# EAGLE design ESP32_breakout v3 (EAGLE 7.7.0)
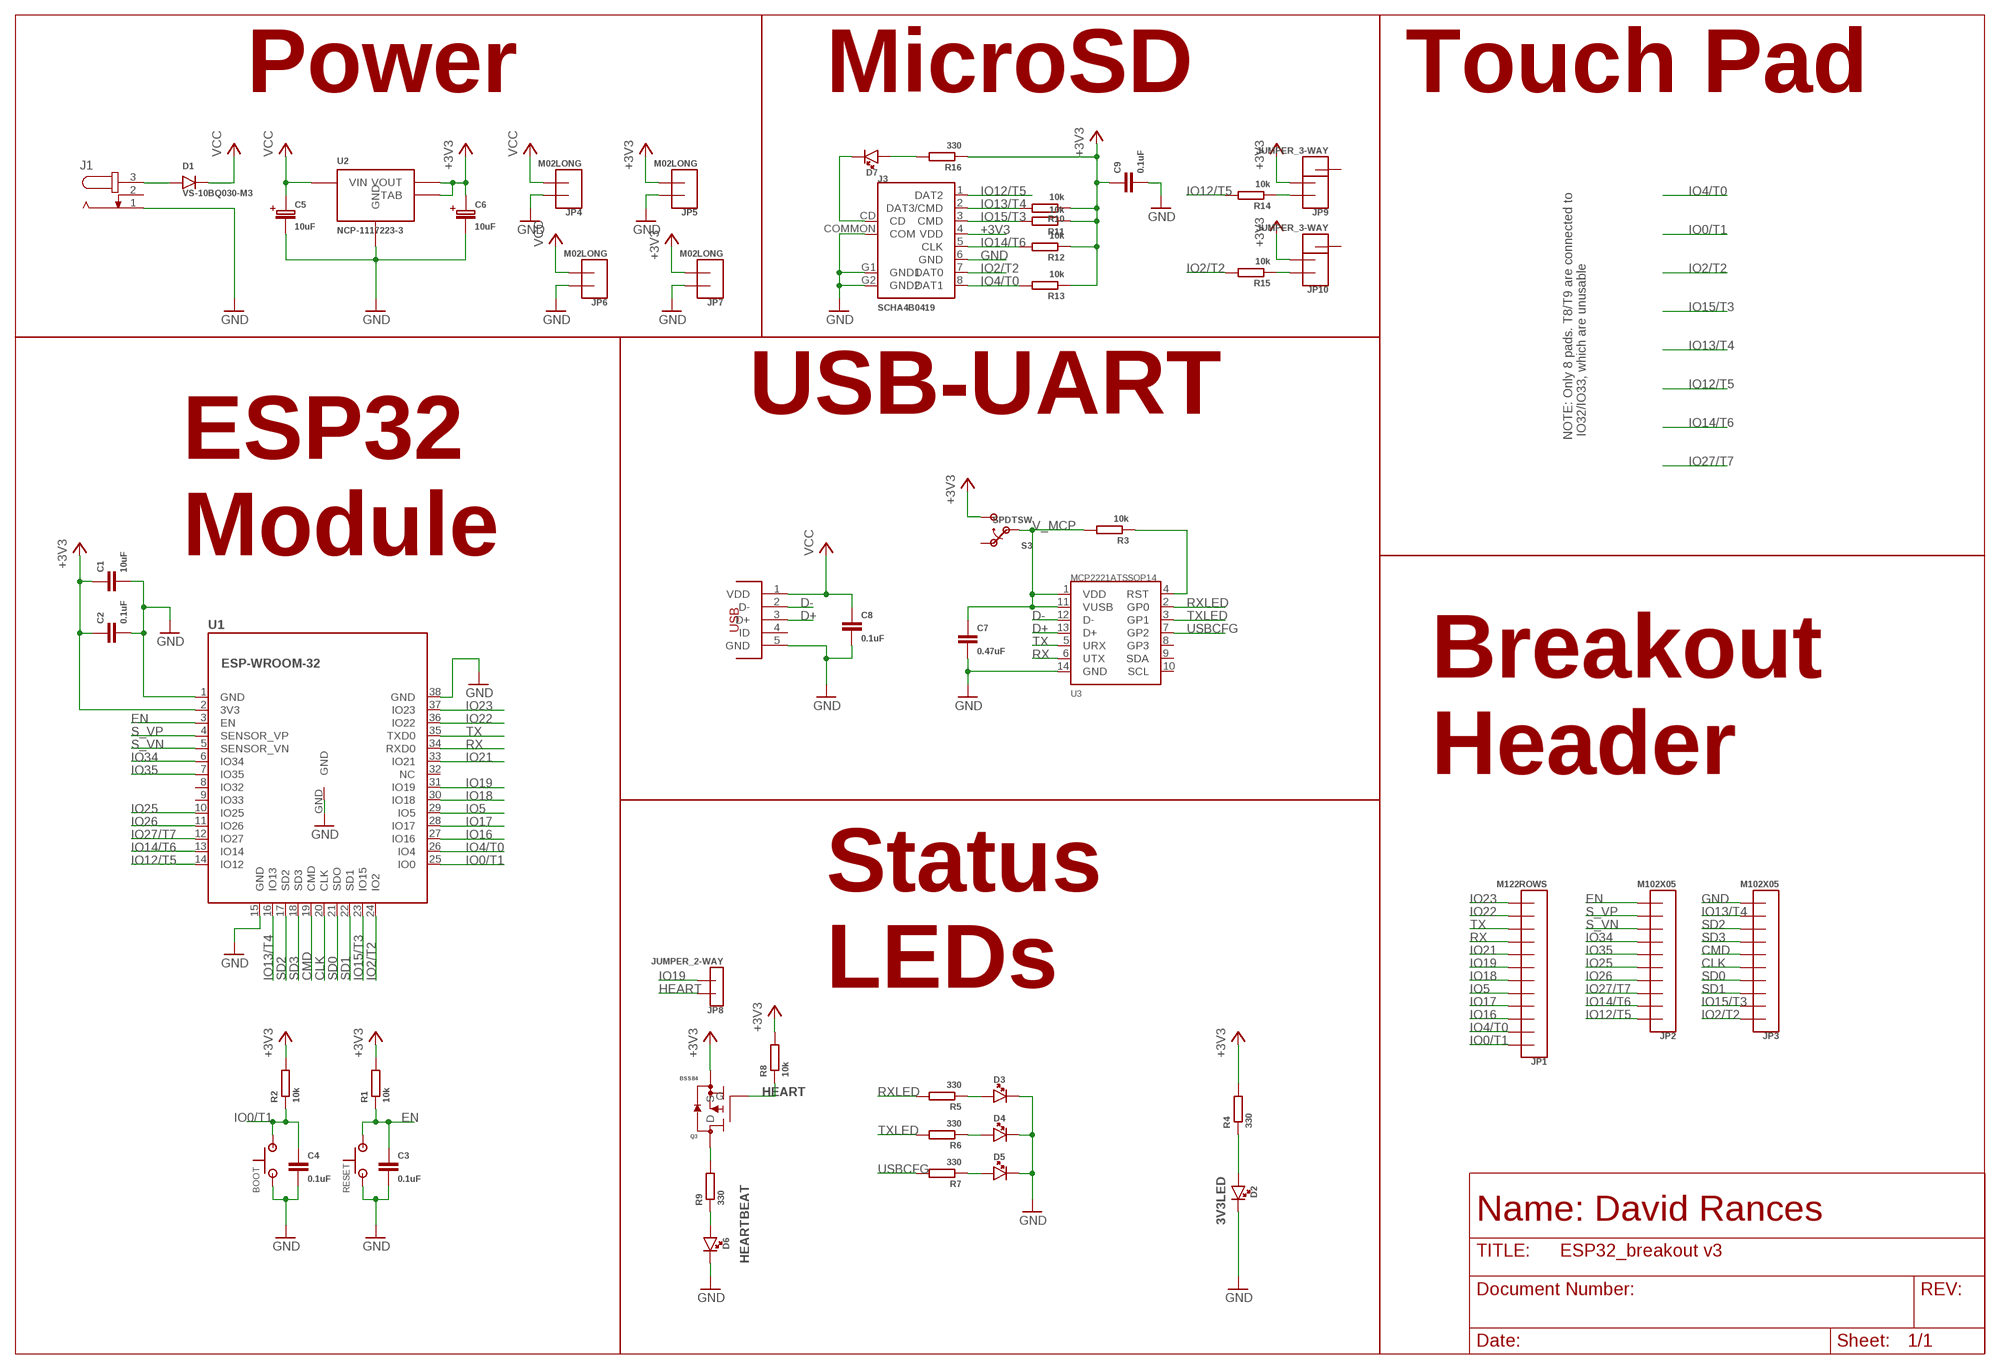
[diagram p0: schematic, sheet 1]

## Parts
BOOT  PUSHBUTTONSKHMQME010  [SKHMQME010]
C1  10uF  CAP0603  [CAP-0603]
C2  0.1uF  CAP0603  [CAP-0603]
C3  0.1uF  CAP0603  [CAP-0603]
C4  0.1uF  CAP0603  [CAP-0603]
C5  10uF  CAP-POLARCASEB-3528  [B-3528]
C6  10uF  CAP-POLARCASEB-3528  [B-3528]
C7  0.47uF  CAP0603  [CAP-0603]
C8  0.1uF  CAP0603  [CAP-0603]
C9  0.1uF  CAP0603  [CAP-0603]
D1  VS-10BQ030-M3  [DO-214AA]
D2  LED1206  [LED-1206]
D3  LED1206  [LED-1206]
D4  LED1206  [LED-1206]
D5  LED1206  [LED-1206]
D6  LED1206  [LED-1206]
D7  LED1206  [LED-1206]
J1  JACK-PLUG0  [SPC4077]
J3  SCHA4B0419  [MICROSD_SCHA4B0419]
JP1  M122ROWS  [2X06]
JP2  M102X05  [2X05]
JP3  M102X05  [2X05]
JP4  M02LONG  [1X02-LONG]
JP5  M02LONG  [1X02-LONG]
JP6  M02LONG  [1X02-LONG]
JP7  M02LONG  [1X02-LONG]
JP8  JUMPER_2-WAY  [1X02]
JP9  JUMPER_3-WAY  [1X03]
JP10  JUMPER_3-WAY  [1X03]
Q3  BSS84  [SOT-23-3]
R1  10k  RESISTOR0603  [RES-0603]
R2  10k  RESISTOR0603  [RES-0603]
R3  10k  RESISTOR0603  [RES-0603]
R4  330  RESISTOR0603  [RES-0603]
R5  330  RESISTOR0603  [RES-0603]
R6  330  RESISTOR0603  [RES-0603]
R7  330  RESISTOR0603  [RES-0603]
R8  10k  RESISTOR0603  [RES-0603]
R9  330  RESISTOR0603  [RES-0603]
R10  10k  RESISTOR0603  [RES-0603]
R11  10k  RESISTOR0603  [RES-0603]
R12  10k  RESISTOR0603  [RES-0603]
R13  10k  RESISTOR0603  [RES-0603]
R14  10k  RESISTOR0603  [RES-0603]
R15  10k  RESISTOR0603  [RES-0603]
R16  330  RESISTOR0603  [RES-0603]
RESET  PUSHBUTTONSKHMQME010  [SKHMQME010]
S3  SPDTSW  [SPDT_TH]
U1  ESP-WROOM-32  [ESP-WROOM-32]
U2  NCP-1117223-3  [SOT-223-3]
U3  MCP2221ATSSOP14  [TSSOP-14]
U$4  MOLEX_USBMICRO  [MOLEX_47346-001]

## Nets
+3V3: C1.1 C2.1 C6.P C9.1 J3.4(VDD) JP5.2 JP7.2 JP9.2 JP10.2 Q3.S R1.2 R2.2 R4.2 R8.2 R10.1 R11.1 R12.1 R13.1 R16.1 S3.3 U1.2(3V3) U2.2(VOUT) U2.PAD(TAB)
CLK: JP3.5 U1.20(CLK)
CMD: JP3.6 U1.19(CMD)
D+: U3.13(D+) U$4.3(D+)
D-: U3.12(D-) U$4.2(D-)
EN: C3.1 JP2.10 R1.1 RESET.3 RESET.4 U1.3(EN)
GND: BOOT.1 BOOT.2 C1.2 C2.2 C3.2 C4.2 C5.N C6.N C7.2 C8.2 C9.2 D2.C D3.C D4.C D5.C D6.C J1.1 J3.6(GND) J3.COMMON(COM) J3.G1(GND1) J3.G2(GND2) JP3.10 JP4.1 JP5.1 JP6.1 JP7.1 RESET.1 RESET.2 U1.1(GND) U1.15(GND) U1.38(GND) U1.GND U2.1(GND) U3.14(GND) U$4.5(GND)
HEART: JP8.1 Q3.G R8.1
IO0/T1: BOOT.3 BOOT.4 C4.1 JP1.1 R2.1 U1.25(IO0)
IO2/T2: J3.7(DAT0) JP3.1 R15.2 U1.24(IO2)
IO4/T0: J3.8(DAT1) JP1.2 R13.2 U1.26(IO4)
IO5: JP1.5 U1.29(IO5)
IO12/T5: J3.1(DAT2) JP2.1 R14.2 U1.14(IO12)
IO13/T4: J3.2(DAT3/CMD) JP3.9 R10.2 U1.16(IO13)
IO14/T6: J3.5(CLK) JP2.2 R12.2 U1.13(IO14)
IO15/T3: J3.3(CMD) JP3.2 R11.2 U1.23(IO15)
IO16: JP1.3 U1.27(IO16)
IO17: JP1.4 U1.28(IO17)
IO18: JP1.6 U1.30(IO18)
IO19: JP1.7 JP8.2 U1.31(IO19)
IO21: JP1.8 U1.33(IO21)
IO22: JP1.11 U1.36(IO22)
IO23: JP1.12 U1.37(IO23)
IO25: JP2.5 U1.10(IO25)
IO26: JP2.4 U1.11(IO26)
IO27/T7: JP2.3 U1.12(IO27)
IO34: JP2.7 U1.6(IO34)
IO35: JP2.6 U1.7(IO35)
N$2: D1.A J1.3
N$3: R3.1 U3.4(RST)
N$4: D5.A R7.1
N$5: D2.A R4.1
N$6: JP9.1 R14.1
N$7: JP10.1 R15.1
N$8: D3.A R5.1
N$9: D6.A R9.1
N$10: Q3.D R9.2
N$11: D4.A R6.1
N$12: D7.C J3.CD
N$14: D7.A R16.2
RX: JP1.9 U1.34(RXD0) U3.6(UTX)
RXLED: R5.2 U3.2(GP0)
S_VN: JP2.8 U1.5(SENSOR_VN)
S_VP: JP2.9 U1.4(SENSOR_VP)
SD0: JP3.4 U1.21(SDO)
SD1: JP3.3 U1.22(SD1)
SD2: JP3.8 U1.17(SD2)
SD3: JP3.7 U1.18(SD3)
TX: JP1.10 U1.35(TXD0) U3.5(URX)
TXLED: R6.2 U3.3(GP1)
USBCFG: R7.2 U3.7(GP2)
V_MCP: C7.1 R3.2 S3.2(OUT) U3.1(VDD) U3.11(VUSB)
VCC: C5.P C8.1 D1.C JP4.2 JP6.2 U2.3(VIN) U$4.1(VDD)
Unconnected: BOOT.5 J1.2 JP9.3 JP10.3 RESET.5 S3.1 U1.8(IO32) U1.9(IO33) U1.32(NC) U3.8(GP3) U3.9(SDA) U3.10(SCL) U$4.4(ID)

## Notes on the sheet
- Power | MicroSD | Touch Pad
- USB-UART
- NOTE: Only 8 pads. T8/T9 are connected to
   IO32/IO33, which are unusable
- ESP32
  Module
- Breakout
  Header
- Status
  LEDs
- Name: David Rances
- 3V3LED
- HEARTBEAT

## Library data of the parts
BOOT RESET = dr-library:PUSHBUTTON: ALPS Tactile Switch 50mA at 12V Mouser Product # 688-SKHMQME010
C1-C4 C7-C9 = dr-library:CAP: Multilayer Ceramic Capacitor
C5 C6 = dr-library:CAP-POLAR
D1 = dr-library:VS-10BQ030-M3: Vishay Semiconductors High Performance Schottky Rectifier 1.0A Mfg. No. VS-10BQ030-M3/5BT http://www.mouser.com/ds/2/427/vs-10bq030-m3-552919.pdf
D2-D7 = dr-library:LED
J1 = EmbeddedAdventures 3:JACK-PLUG: DC POWER JACK Power Jack, DC, Right Angle, Through Hole, Rated 5A at 16VDC, PC Terminals Distributor: Farnell (www.Farnell.de) Drawing: 84N1161.pdf / 84N1162.pdf Manufacturer: SPC Technology (www.spctechnology.com) Type: SPC4077 / SPC 4078
J3 = dr-library:SCHA4B0419: ALPS MicroSD Connector Manufacturer No. SCHA4B0419 http://www2.mouser.com/ProductDetail/ALPS/SCHA4B0419/?qs=sGAEpiMZZMuJakaoiLiBpsFSICW6cUCj0ci6XSEAGXcTwv1T7afZMw%3d%3d
JP1 = dr-library:M12
JP2 JP3 = dr-library:M10
JP4-JP7 = dr-library:M02
JP8 = dr-library:JUMPER_2-WAY
JP9 JP10 = dr-library:JUMPER_3-WAY
Q3 = dr-library:BSS84: Fairchild Semiconductor P-Channel Enhancement Mode MOSFET Mfg. No. BSS84 Mouser No. 512-BSS84 http://www.mouser.com/ds/2/149/BSS84-1006729.pdf
R1-R16 = dr-library:RESISTOR
S3 = dr-library:SPDT
U1 = dr-library:ESP-WROOM-32
U2 = dr-library:NCP-1117: ON Semiconductor Low Dropout Positive Voltage Regulator 1A output Datasheet: http://www.mouser.com/ds/2/308/NCP1117LP-D-82673.pdf
U3 = dr-library:MCP2221A: MCP2221A USB 2.0 to I2C/UART Protocol Converter with GPIO Microchip http://ww1.microchip.com/downloads/en/DeviceDoc/20005565B.pdf Mouser Part #579-MCP2221A-I/ST
U$4 = dr-library:MOLEX_USBMICRO

## Board
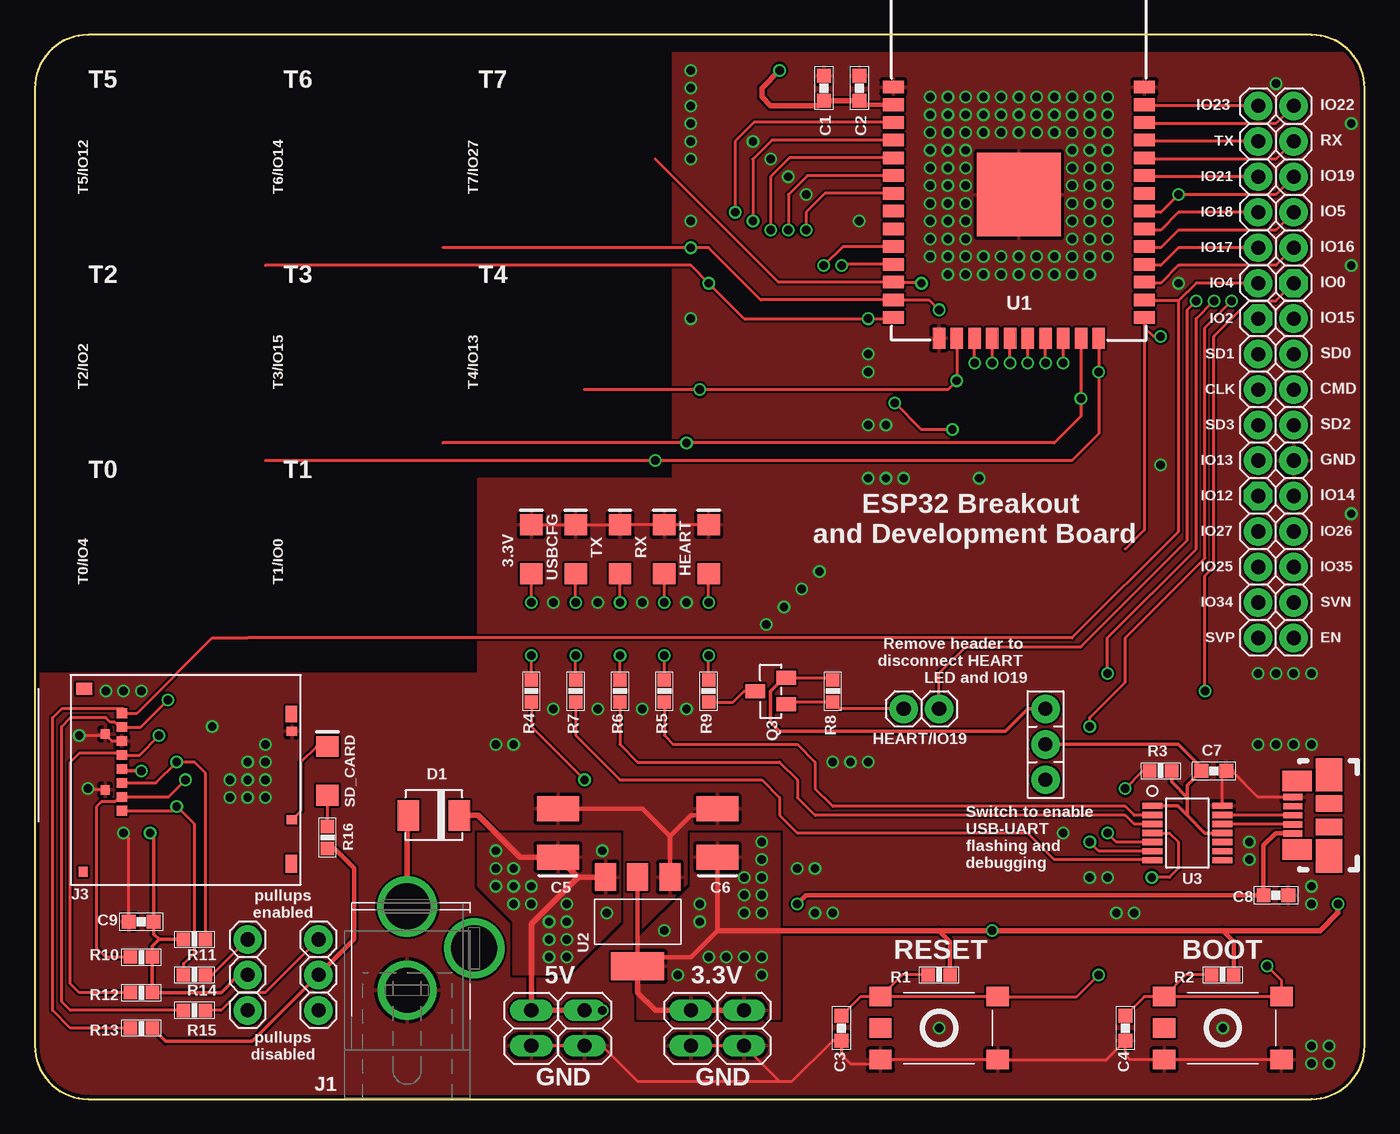
[diagram p1: board, top side]
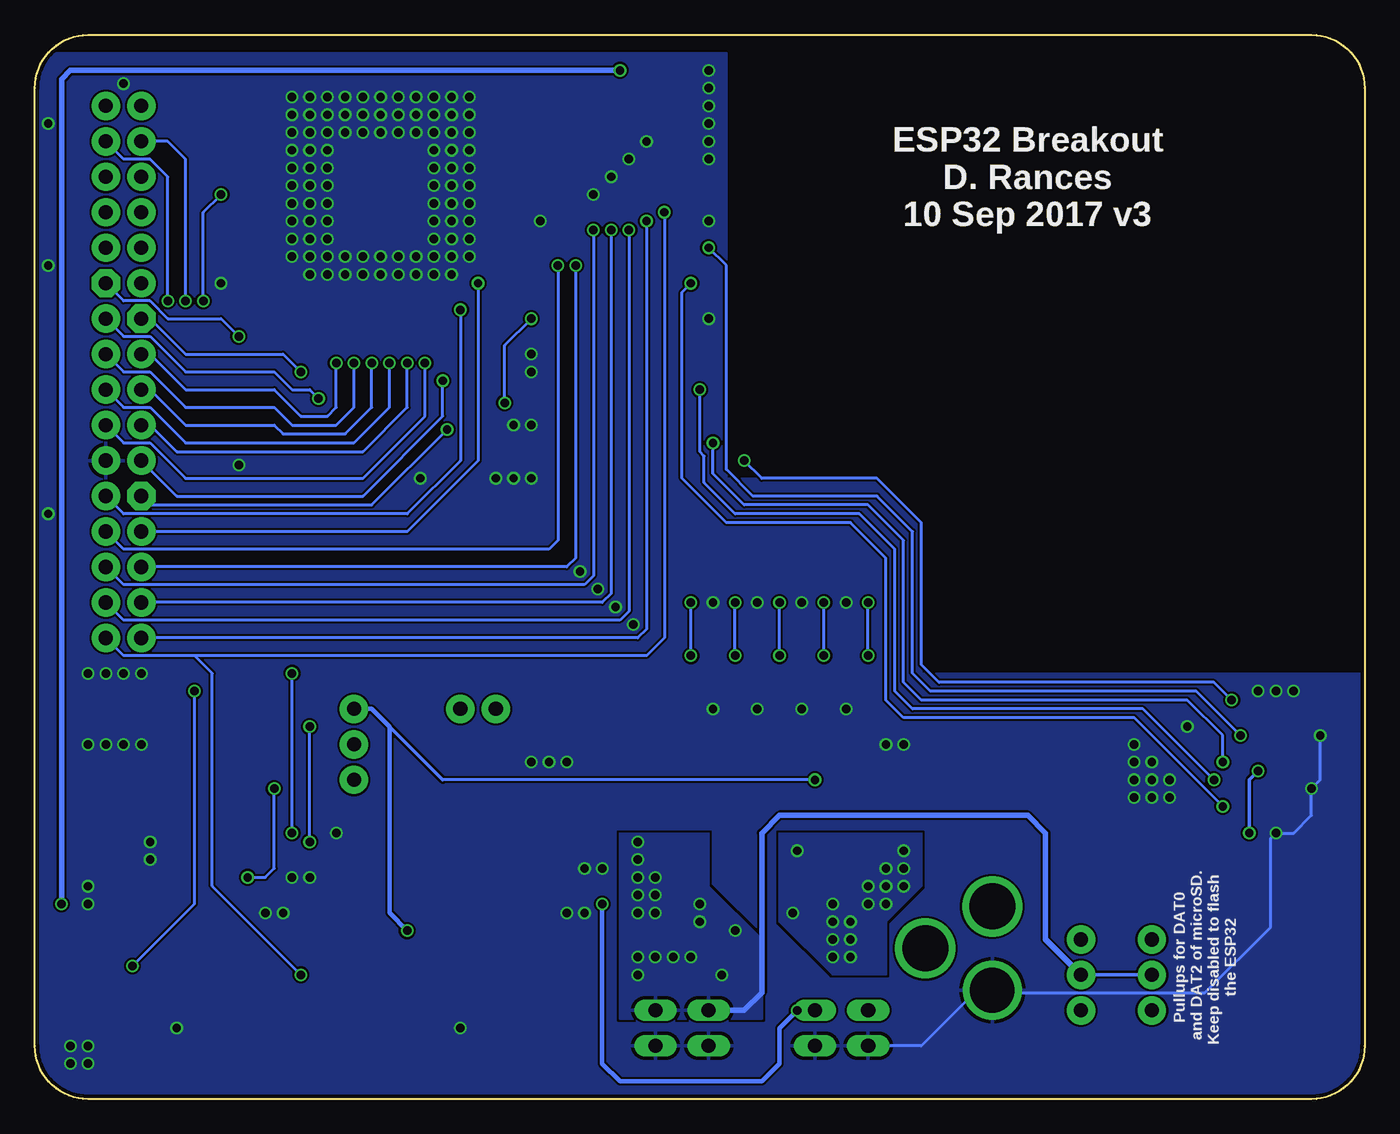
[diagram p2: board, bottom side, seen from below]

Size 95.25 x 76.2 mm. Coordinates in mm from the lower left corner, seen from the top.
Outline: 3.81,76.2 arc90 0,72.39 0,3.81 arc90 3.81,0 91.44,0 arc90 95.25,3.81 95.25,72.39 arc90 91.44,76.2 3.81,76.2
Copper layers (1*16): Top 0.035mm / dielectric 1.5mm / Bottom 0.035mm
Design rules "SeeedStudio_2layer_DRU_no_angle_20140221": minimum track width 6mil, minimum drill 12mil, track to track 6mil, track to pad 6mil, pad to pad 6mil, via to via 6mil, smd to smd 0mil, copper to edge 10mil, drill to drill 10mil, minimum pad ring 10mil, minimum via ring 6mil, stop-mask expansion 2mil, vias tented up to drill 100mil, thermal gap 10mil
tKeepout: 6 lines

### Footprints (pad centres in the part's own frame; a part is rotated, then mirrored left to right if it is on the bottom)
SKHMQME010 = smd 1.6 x 1.4: 1 -4.2,2.25; 2 4.2,2.25; 3 -4.2,-2.25; 4 4.2,-2.25; 5 4.2,0
CAP-0603 = smd 1 x 1: 1 -0.889,0; 2 0.889,0
B-3528 = smd 1.8 x 3: N 1.725,0; P -1.725,0
DO-214AA = smd 1.52 x 2.18: A 1.83,0; C -1.83,0
LED-1206 = smd 1.5 x 1.6: A -1.75,0; C 1.75,0
SPC4077 = drill 3.2: 1 -3,0 | drill 3.3: 2 0,-4.8; 3 3,0
MICROSD_SCHA4B0419 = smd 0.7 x 0.75: 1 2.225,-12.825; 2 1.225,-12.825; 3 0.225,-12.825; 4 -0.775,-12.825; 5 -1.775,-12.825; 6 -2.775,-12.825; 7 -3.775,-12.825; 8 -4.775,-12.825 | smd 0.65 x 0.75: CD 2.875,-0.625; COMMON -3.475,-0.625 | smd 0.7 x 0.65: G1 -3.275,-14.025; G2 0.725,-14.025; P$1 6.575,-15.575 | smd 0.855 x 1.15: P$2 -6.515,-15.525 | smd 1.2 x 0.85: P$3 -4.713,-0.675 | smd 1.3 x 0.85: P$6 6.013,-0.675
2X06 = drill 1.016 pad 2.032 octagon: 1 -1.27,-2.54 | drill 1.016 pad 2.032: 2 -1.27,0; 3 1.27,-2.54; 4 1.27,0; 5 3.81,-2.54; 6 3.81,0; 7 6.35,-2.54; 8 6.35,0; 9 8.89,-2.54; 10 8.89,0; 11 11.43,-2.54; 12 11.43,0
2X05 = drill 1.016 pad 2.032 octagon: 1 -1.27,-2.54 | drill 1.016 pad 2.032: 2 -1.27,0; 3 1.27,-2.54; 4 1.27,0; 5 3.81,-2.54; 6 3.81,0; 7 6.35,-2.54; 8 6.35,0; 9 8.89,-2.54; 10 8.89,0
1X02-LONG = drill 1.016 long: 1 -1.27,0; 2 1.27,0
1X02 = drill 1.016 pad 2.032: 1 -1.27,0; 2 1.27,0
1X03 = drill 1.016 pad 2.032: 1 -1.27,0; 2 1.27,0; 3 3.81,0
SOT-23-3 = smd 1 x 1.4: D 0,1.1; G -0.95,-1.1; S 0.95,-1.1
RES-0603 = smd 0.965 x 0.965: 1 -0.787,0; 2 0.787,0
SPDT_TH = drill 1.016 pad 2.032: 1 -1.27,0; 2 1.27,0; 3 3.81,0
ESP-WROOM-32 = smd 0.9 x 1.5: 1 7.7,9; 2 6.43,9; 3 5.16,9; 4 3.89,9; 5 2.62,9; 6 1.35,9; 7 0.08,9; 8 -1.19,9; 9 -2.46,9; 10 -3.73,9; 11 -5,9; 12 -6.27,9; 13 -7.54,9; 14 -8.81,9; 25 -8.81,-9; 26 -7.54,-9; 27 -6.27,-9; 28 -5,-9; 29 -3.73,-9; 30 -2.46,-9; 31 -1.19,-9; 32 0.08,-9; 33 1.35,-9; 34 2.62,-9; 35 3.89,-9; 36 5.16,-9; 37 6.43,-9; 38 7.7,-9 | smd 1.5 x 0.9: 15 -10.3,5.715; 16 -10.3,4.445; 17 -10.3,3.175; 18 -10.3,1.905; 19 -10.3,0.635; 20 -10.3,-0.635; 21 -10.3,-1.905; 22 -10.3,-3.175; 23 -10.3,-4.445; 24 -10.3,-5.715 | smd 6 x 6: GND 0,0
SOT-223-3 = smd 1.5 x 2: 1 -2.3,-3.2; 2 0,-3.2; 3 2.3,-3.2 | smd 3.8 x 2: PAD 0,3.2
TSSOP-14 = smd 0.45 x 1.45: 1 1.95,2.5; 2 1.3,2.5; 3 0.65,2.5; 4 0,2.5; 5 -0.65,2.5; 6 -1.3,2.5; 7 -1.95,2.5; 8 -1.95,-2.5; 9 -1.3,-2.5; 10 -0.65,-2.5; 11 0,-2.5; 12 0.65,-2.5; 13 1.3,-2.5; 14 1.95,-2.5
MOLEX_47346-001 = smd 1.38 x 0.45: 1 2.61,1.3; 2 2.61,0.65; 3 2.61,0; 4 2.61,-0.65; 5 2.61,-1.3 | smd 2.1 x 1.475: P$1 2.3,2.462; P$2 2.3,-2.462 | smd 1.9 x 1.175: P$3 0,0.838; P$4 0,-0.838 | smd 1.9 x 2.375: P$5 0,2.913; P$6 0,-2.913

### Placement (x,y rotation side)
BOOT  85.09,5.08 180 top
C1  56.52,72.39 90 top
C2  59.05,72.39 90 top
C3  57.78,5.08 270 top
C4  78.11,5.08 270 top
C5  37.47,19.05 90 top
C6  48.9,19.05 90 top
C7  84.45,23.5 0 top
C8  88.9,14.61 0 top
C9  7.62,12.7 180 top
D1  28.57,20.32 180 top
D2  35.56,39.37 90 top
D3  45.09,39.37 90 top
D4  41.91,39.37 90 top
D5  38.73,39.37 90 top
D6  48.26,39.37 90 top
D7  20.95,23.5 90 top
J1  26.67,10.79 90 top
J3  19.05,22.86 270 top
JP1  87.63,59.69 90 top
JP2  90.17,41.91 270 top
JP3  90.17,54.61 270 top
JP4  39.37,5.08 90 top
JP5  50.8,5.08 90 top
JP6  35.56,5.08 90 top
JP7  46.99,5.08 90 top
JP8  63.5,27.94 0 top
JP9  15.24,10.16 270 top
JP10  20.32,10.16 270 top
Q3  52.7,29.21 90 top
R1  64.77,8.89 0 top
R2  85.09,8.89 0 top
R3  80.64,23.5 0 top
R4  35.56,29.21 270 top
R5  45.09,29.21 270 top
R6  41.91,29.21 270 top
R7  38.73,29.21 270 top
R8  57.15,29.21 90 top
R9  48.26,29.21 270 top
R10  7.62,10.16 180 top
R11  11.43,11.43 0 top
R12  7.62,7.62 180 top
R13  7.62,5.08 180 top
R14  11.43,8.89 180 top
R15  11.43,6.35 180 top
R16  20.95,18.73 90 top
RESET  64.77,5.08 180 top
S3  72.39,24.13 90 top
U1  70.48,64.77 90 top
U2  43.18,12.7 180 top
U3  82.55,19.05 90 top
U$4  92.71,20.32 180 top

### Tracks (layer width: path | path; a pad name or v marks a point on that pad's centre or on a via)
+3V3  (via drill 0.6)
  Top 0.203: 6.37,23.5 J3.4 | 53.66,30.16 Q3.S 56.99,30.16 R8.2 | R4.2 35.56,26.67 v39.37,22.86
  Top 0.254: v8.26,19.05 8.51,18.8 C9.1 8.51,11.81 8.89,11.43 | v7.62,23.5 6.37,23.5 | 8.89,11.43 R11.1 | 8.89,11.43 8.41,10.95 R10.1 R12.1 13.34,7.62 14.61,8.89 JP9.2 | 53.66,30.16 52.7,29.21 52.7,26.99 53.34,26.35 69.53,26.35 71.12,27.94 S3.3 | JP10.2 15.56,4.13 9.36,4.13 R13.1
  Top 0.305: U2.2 43.18,10.16 | 43.18,10.16 U2.PAD | C6.P 48.9,12.06 46.99,10.16 43.18,10.16 | U1.2 59.36,71.2 C2.1 | R2.2 85.88,11.28 85.09,12.06 | R1.2 65.56,11.28 64.77,12.06 | R16.1 21.43,17.95 22.86,16.51 22.86,11.43 JP10.2
  Top 0.406: 48.9,12.06 64.77,12.06 v68.58,12.06 85.09,12.06 92.08,12.06 93.34,13.34 v93.34,13.97 | v53.34,73.66 52.07,72.39 52.07,71.75 52.7,71.12 56.13,71.12 C1.1 C2.1 | U2.PAD 43.18,7.62 44.45,6.35 JP7.2 JP5.2
  Bottom 0.203: v39.37,22.86 66.04,22.86
  Bottom 0.254: v8.26,19.05 8.26,22.86 v7.62,23.5 | 66.04,22.86 69.85,26.67 | JP9.2 JP10.2
  Bottom 0.305: S3.3 71.12,27.94 69.85,26.67 69.85,13.34 v68.58,12.06
  Bottom 0.406: v93.34,13.97 93.34,73.03 92.71,73.66 v53.34,73.66 | JP7.2 44.45,6.35 43.18,7.62 43.18,19.05 41.91,20.32 24.13,20.32 22.86,19.05 22.86,11.43 JP10.2
  other vias: 52.07,10.16 50.8,10.16 49.53,10.16 48.26,10.16 52.07,8.89 52.07,13.34 50.8,13.34 50.8,14.61 52.07,14.61 52.07,15.88 50.8,15.88 52.07,17.14 52.07,18.41 47.62,13.97 47.62,12.7 45.09,12.06 46.04,8.89
  pour Top: 46.99,19.05 53.34,19.05 53.34,5.71 43.18,5.71 43.18,11.43 46.99,15.24
  pour Bottom: 46.99,19.05 46.99,15.24 43.18,11.43 43.18,5.71 53.34,5.71 53.34,19.05
CLK  (via drill 0.6)
  Top 0.203: v71.12,52.7 U1.20
  Bottom 0.203: JP3.5 87,50.8 84.45,48.26 78.11,48.26 77.47,47.62 73.03,47.62 71.12,49.53 v71.12,52.7
CMD  (via drill 0.6)
  Top 0.203: v69.85,52.7 U1.19
  Bottom 0.203: JP3.6 88.9,49.53 87,49.53 84.45,46.99 72.39,46.99 69.85,49.53 v69.85,52.7
D+
  Top 0.203: U$4.3 85.08,20.32 U3.13
D-
  Top 0.203: U$4.2 85.08,19.67 U3.12
EN  (via drill 0.6)
  Top 0.203: U1.3 51.52,69.93 50.16,68.58 v50.16,63.5 | R1.1 62.13,8.89 RESET.4 | RESET.4 59.15,7.33 C3.1 | RESET.4 RESET.3 74.64,7.33 v76.2,8.89
  Bottom 0.203: v50.16,63.5 50.16,33.02 51.44,31.75 83.82,31.75 | 83.82,31.75 88.9,31.75 JP2.10 | 83.82,31.75 82.55,30.48 82.55,15.24 v76.2,8.89
GND  (via drill 0.6)
  Top 0.203: J3.6 5.53,25.64 J3.G1 4.92,26.04 v3.17,26.04 | BOOT.1 BOOT.2 78.45,2.83 78.11,3.17 C4.2 76.74,2.83 RESET.1 61.25,2.83 60.96,2.54 60.86,2.54 RESET.2 60.28,2.54 58.42,2.54 57.78,3.17 C3.2 57.15,4.19 54.23,1.27 53.34,1.27 | U$4.5 87.6,21.62 85.72,23.5 C7.2 85.05,23.2 U3.14 | JP7.1 JP5.1 53.34,1.27 | JP6.1 JP4.1 40.64,3.81 43.18,1.27 53.34,1.27 | J3.G2 3.9,22.14 v3.81,22.23 | C9.2 6.73,18.67 v6.35,19.05 | D2.C D5.C D4.C D3.C D6.C
  Top 0.305: U2.1 45.48,18.81 | 45.48,18.81 46.99,20.32 48.44,20.32 C6.N | C5.N 43.52,20.77 45.48,18.81
  Bottom 0.203: v3.17,26.04 3.17,22.86 v3.81,22.23 3.81,20.32 5.08,19.05 v6.35,19.05 6.73,18.67 6.73,12.32 11.43,7.62 25.4,7.62 25.57,7.79 J1.1 27.77,7.79 31.75,3.81 JP6.1
  other vias: 70.48,69.22 69.22,69.22 67.94,69.22 66.67,69.22 66.67,67.94 66.67,66.67 66.67,65.41 66.67,64.14 66.67,62.87 66.67,61.59 71.75,69.22 73.03,69.22 74.3,69.22 75.56,69.22 74.3,67.94 74.3,66.67 74.3,65.41 74.3,62.87 74.3,64.14 74.3,61.59 46.99,62.87 59.69,53.34 52.39,33.97 46.67,35.56 43.5,35.56 40.32,35.56 37.15,35.56 57.15,24.13 12.7,26.67 16.51,25.4 15.24,21.59 51.44,68.58 52.7,67.31 53.98,66.04 55.24,64.77 60.96,48.26 67.63,44.45 54.93,36.51 6.35,29.21 62.23,44.45 90.17,30.48 85.09,5.08 64.77,5.08 54.61,16.51 34.29,25.4 59.05,62.87 81.92,58.42 46.67,27.94 43.5,27.94 40.32,27.94 37.15,27.94 46.99,55.88 75.56,67.94 75.56,66.67 75.56,65.41 75.56,64.14 75.56,62.87 75.56,61.59 76.83,61.59 76.83,62.87 76.83,64.14 76.83,65.41 76.83,66.67 76.83,67.94 76.83,69.22 73.03,60.33 74.3,60.33 75.56,60.33 76.83,60.33 71.75,60.33 70.48,60.33 69.22,60.33 67.94,60.33 66.67,60.33 65.41,60.33 64.14,60.33 65.41,61.59 64.14,61.59 64.14,62.87 65.41,62.87 65.41,64.14 65.41,65.41 65.41,66.67 65.41,67.94 65.41,69.22 64.14,64.14 64.14,65.41 64.14,66.67 64.14,67.94 64.14,69.22 64.14,70.48 64.14,71.75 65.41,70.48 66.67,70.48 67.94,70.48 69.22,70.48 70.48,70.48 71.75,70.48 73.03,70.48 74.3,70.48 75.56,70.48 76.83,70.48 76.83,71.75 75.56,71.75 74.3,71.75 73.03,71.75 71.75,71.75 70.48,71.75 69.22,71.75 67.94,71.75 66.67,71.75 65.41,71.75 46.99,67.31 46.99,68.58 80.64,45.4 56.2,37.78 53.66,35.24 16.51,24.13 16.51,22.86 16.51,21.59 15.24,22.86 15.24,24.13 13.97,22.86 13.97,21.59 5.08,29.21 7.62,29.21 46.99,69.85 46.99,71.12 46.99,72.39 46.99,73.66 88.9,72.71 91.44,30.48 88.9,30.48 87.63,30.48 91.44,25.4 90.17,25.4 88.9,25.4 87.63,25.4 92.71,2.54 92.71,3.81 91.44,3.81 91.44,2.54 58.42,24.13 59.69,24.13 60.96,44.45 59.69,44.45 59.69,48.26 59.69,52.07 65.41,59.05 66.67,59.05 67.94,59.05 69.22,59.05 70.48,59.05 71.75,59.05 73.03,59.05 74.3,59.05 75.56,59.05 78.74,13.34 77.47,13.34 55.88,13.34 57.15,13.34 76.83,15.88 75.56,15.88 55.88,16.51 73.66,19.05 91.44,15.24 91.44,13.97 87,17.14 87,18.41 94.3,69.85 94.3,59.69 94.3,41.91 33.02,25.4
  pour Top (rank 2): -2.54,30.48 31.75,30.48 31.75,44.45 45.72,44.45 45.72,74.93 99.06,74.93 99.06,-2.54 -2.54,-2.54
  pour Bottom (rank 2): -2.54,30.48 -2.54,-2.54 99.06,-2.54 99.06,74.93 45.72,74.93 45.72,44.45 31.75,44.45 31.75,30.48
HEART
  Top 0.203: JP8.1 57.63,27.94 R8.1 53.97,28.42 Q3.G
IO0/T1  (via drill 0.6)
  Top 0.203: U1.25 79.48,55.24 | 79.48,55.24 79.48,40.75 78.11,39.37 | v80.64,54.61 80.12,54.61 79.48,55.24 | R2.1 82.45,8.89 BOOT.4 | BOOT.4 79.47,7.33 C4.1 | v83.82,29.21 83.82,37.47 84.45,38.1 84.45,54.61 87,57.15 88.9,57.15 JP1.1 | BOOT.4 BOOT.3 89.29,8.5 v88.27,9.53
  Bottom 0.203: v80.64,54.61 81.92,55.88 85.72,55.88 87,57.15 88.9,57.15 JP1.1 | v83.82,29.21 83.82,13.97 v88.27,9.53
IO2/T2  (via drill 0.6)
  Top 0.203: U1.24 v76.2,52.07 76.2,47.62 74.3,45.72 v44.45,45.72 16.51,45.72 | v9.53,28.57 7.58,26.64 J3.7 6.07,26.64 5.71,26.99 5.4,26.99 5.08,27.3 2.54,27.3 1.91,26.67 1.91,6.99 2.54,6.35 R15.2
  Bottom 0.203: v9.53,28.57 10.79,29.84 30.48,29.84 31.75,31.11 31.75,41.27 34.92,44.45 43.18,44.45 v44.45,45.72 | JP3.1 87,55.88 84.45,53.34 77.47,53.34 v76.2,52.07
IO4/T0
  Top 0.203: 81.92,57.15 81.92,40.64 74.3,33.02 15.24,33.02 12.7,33.02 7.32,27.64 J3.8 6.22,27.82 6.35,27.94 1.91,27.94 1.27,27.3 1.27,6.35 2.54,5.08 R13.2 | JP1.2 83.19,58.42 81.92,57.15 | 81.92,57.15 79.56,57.15 U1.26
IO5
  Top 0.203: JP1.5 88.9,62.23 81.92,62.23 80.64,60.96 79.56,60.96 U1.29
IO12/T5  (via drill 0.6)
  Top 0.203: 16.51,59.69 46.99,59.69 v48.26,58.42 50.8,55.88 v59.69,55.88 61.41,55.88 U1.14 | J3.1 9.84,20.64 v10.16,20.95 11.43,19.68 11.43,10.48 10.64,9.69 R14.2 | v65.72,47.94 63.5,47.94 v61.59,49.85
  Bottom 0.203: v10.16,20.95 16.51,27.3 33.02,27.3 34.29,28.57 34.29,38.73 36.83,41.27 45.72,41.27 48.9,44.45 48.9,57.78 v48.26,58.42 | JP2.1 87,42.55 71.12,42.55 v65.72,47.94 | v61.59,49.85 61.59,53.98 v59.69,55.88
IO13/T4  (via drill 0.6)
  Top 0.203: U1.16 v66.04,51.44 65.41,50.8 v47.62,50.8 39.37,50.8 | v10.79,22.86 9.57,21.64 J3.2 6.08,21.64 5.71,21.27 4.76,21.27 4.45,20.95 4.45,10.79 5.08,10.16 R10.2
  Bottom 0.203: v10.79,22.86 15.88,27.94 32.38,27.94 33.66,29.21 33.66,39.37 36.2,41.91 45.09,41.91 47.31,44.13 47.31,46.04 47.62,46.35 v47.62,50.8 | JP3.9 85.09,43.18 71.75,43.18 66.04,48.9 v66.04,51.44
IO14/T6  (via drill 0.6)
  Top 0.203: 29.21,60.96 v46.99,60.96 48.26,60.96 51.99,57.23 U1.13 64.06,57.23 v64.77,56.52 | v8.89,26.04 7.49,24.64 J3.5 6.16,24.64 6.03,24.77 3.17,24.77 2.54,24.13 2.54,8.26 3.17,7.62 R12.2
  Bottom 0.203: v8.89,26.04 12.06,29.21 31.11,29.21 32.38,30.48 32.38,40.64 34.92,43.18 43.81,43.18 45.72,45.09 45.72,59.69 v46.99,60.96 | v64.77,56.52 64.77,45.72 68.58,41.91 88.9,41.91 JP2.2
IO15/T3  (via drill 0.6)
  Top 0.203: U1.23 v74.93,50.16 74.93,48.9 73.03,46.99 v46.67,46.99 29.21,46.99 | J3.3 8.66,22.64 v10.16,24.13 11.43,24.13 12.22,23.34 R11.2
  Bottom 0.203: v10.16,24.13 10.16,26.04 12.7,28.57 31.75,28.57 33.02,29.84 33.02,40.01 35.56,42.55 44.45,42.55 46.67,44.77 v46.67,46.99 | JP3.2 88.9,54.61 87,54.61 84.45,52.07 78.11,52.07 76.83,50.8 75.56,50.8 v74.93,50.16
IO16
  Top 0.203: JP1.3 88.9,59.69 81.92,59.69 80.64,58.42 79.56,58.42 U1.27
IO17
  Top 0.203: JP1.4 81.92,60.96 80.64,59.69 79.56,59.69 U1.28
IO18
  Top 0.203: JP1.6 81.92,63.5 80.64,62.23 79.56,62.23 U1.30
IO19  (via drill 0.6)
  Top 0.203: JP1.7 88.9,64.77 v81.92,64.77 80.64,63.5 79.56,63.5 U1.31 | JP8.2 64.77,30.48 66.67,32.38 74.93,32.38 82.55,40.01 82.55,56.52 v83.19,57.15
  Bottom 0.203: v83.19,57.15 83.19,63.5 v81.92,64.77
IO21
  Top 0.203: JP1.8 79.56,66.04 U1.33
IO22
  Top 0.203: JP1.11 88.9,69.85 79.56,69.85 U1.36
IO23
  Top 0.203: JP1.12 79.56,71.12 U1.37
IO25  (via drill 0.6)
  Top 0.203: v56.52,59.69 57.87,61.04 U1.10
  Bottom 0.203: v56.52,59.69 56.52,38.73 57.15,38.1 JP2.5
IO26  (via drill 0.6)
  Top 0.203: v57.78,59.69 57.87,59.77 U1.11
  Bottom 0.203: v57.78,59.69 57.78,40.01 58.42,39.37 88.9,39.37 JP2.4
IO27/T7  (via drill 0.6)
  Top 0.203: 44.45,67.31 53.26,58.5 U1.12 63.42,58.5 v63.5,58.42
  Bottom 0.203: v63.5,58.42 63.5,45.72 68.58,40.64 JP2.3
IO34  (via drill 0.6)
  Top 0.203: U1.6 55.33,66.12 53.98,64.77 v53.98,62.23
  Bottom 0.203: v53.98,62.23 53.98,36.2 54.61,35.56 JP2.7
IO35  (via drill 0.6)
  Top 0.203: U1.7 56.59,64.85 55.24,63.5 v55.24,62.23
  Bottom 0.203: v55.24,62.23 55.24,37.47 55.88,36.83 88.9,36.83 JP2.6
N$2
  Top 0.305: 26.67,20.25 D1.A
  Top 0.406: J1.3 26.67,20.25
N$3  (via drill 0.6)
  Top 0.203: U3.4 81.28,19.05 81.92,18.41 81.92,16.51 81.28,15.88 v80.01,15.88 | v78.11,22.23 79.38,23.5 R3.1
  Bottom 0.203: v80.01,15.88 78.74,15.88 78.11,16.51 v78.11,22.23
N$4  (via drill 0.6)
  Top 0.203: R7.1 v38.73,31.75 | v38.73,35.56 D5.A
  Bottom 0.203: v38.73,31.75 v38.73,35.56
N$5  (via drill 0.6)
  Top 0.203: R4.1 v35.56,31.75 | v35.56,35.56 D2.A
  Bottom 0.203: v35.56,31.75 v35.56,35.56
N$6
  Top 0.203: R14.1 12.7,8.89 JP9.1
N$7
  Top 0.203: JP10.1 16.51,7.62 14.61,7.62 13.34,6.35 R15.1
N$8  (via drill 0.6)
  Top 0.203: R5.1 v45.09,31.75 | v45.09,35.56 D3.A
  Bottom 0.203: v45.09,31.75 v45.09,35.56
N$9  (via drill 0.6)
  Top 0.203: R9.1 v48.26,31.75 | v48.26,35.56 D6.A
  Bottom 0.203: v48.26,31.75 v48.26,35.56
N$10
  Top 0.203: R9.2 50.01,28.42 50.8,29.21 Q3.D
N$11  (via drill 0.6)
  Top 0.203: R6.1 v41.91,31.75 | v41.91,35.56 D4.A
  Bottom 0.203: v41.91,31.75 v41.91,35.56
N$12
  Top 0.203: D7.C 20.16,25.25 19.05,24.13 19.05,20.61 J3.CD
N$14
  Top 0.203: R16.2 D7.A
RX  (via drill 0.6)
  Top 0.203: JP1.9 88.9,67.31 79.56,67.31 U1.34 | U3.6 76.23,17.75 v75.56,18.41 | v75.56,26.67 75.56,27.3 78.11,29.84 78.11,33.02 83.82,38.73 83.82,55.24 v85.72,57.15
  Bottom 0.203: v75.56,18.41 v75.56,26.67 | v85.72,57.15 85.72,66.04 87,67.31 88.9,67.31 JP1.9
RXLED
  Top 0.203: R5.2 45.09,26.04 45.72,25.4 54.61,25.4 55.88,24.13 55.88,22.23 57.15,20.95 78.11,20.95 78.74,20.32 80.02,20.32 U3.2
S_VN  (via drill 0.6)
  Top 0.203: U1.5 54.05,67.39 52.7,66.04 v52.7,62.23
  Bottom 0.203: v52.7,62.23 52.7,34.92 53.34,34.29 88.9,34.29 JP2.8
S_VP  (via drill 0.6)
  Top 0.203: U1.4 52.78,68.66 51.44,67.31 v51.44,62.87
  Bottom 0.203: v51.44,62.87 51.44,33.66 52.07,33.02 JP2.9
SD0  (via drill 0.6)
  Top 0.203: v72.39,52.7 U1.21
  Bottom 0.203: JP3.4 88.9,52.07 87,52.07 84.45,49.53 78.11,49.53 76.83,48.26 73.66,48.26 72.39,49.53 v72.39,52.7
SD1  (via drill 0.6)
  Top 0.203: v73.66,52.7 U1.22
  Bottom 0.203: JP3.3 87,53.34 84.45,50.8 78.11,50.8 76.2,48.9 74.3,48.9 73.66,49.53 v73.66,52.7
SD2  (via drill 0.6)
  Top 0.203: v67.31,52.7 U1.17
  Bottom 0.203: JP3.8 88.9,46.99 87,46.99 84.45,44.45 71.75,44.45 67.31,48.9 v67.31,52.7
SD3  (via drill 0.6)
  Top 0.203: v68.58,52.7 U1.18
  Bottom 0.203: JP3.7 87,48.26 85.09,46.35 71.75,46.35 68.58,49.53 v68.58,52.7
TX  (via drill 0.6)
  Top 0.203: JP1.10 79.56,68.58 U1.35 | U3.5 77.48,18.4 v76.83,19.05 | v76.83,30.48 76.83,33.02 83.19,39.37 83.19,55.88 v84.45,57.15
  Bottom 0.203: v76.83,19.05 v76.83,30.48 | v84.45,57.15 84.45,67.31 85.72,68.58 JP1.10
TXLED
  Top 0.203: R6.2 41.91,25.4 43.18,24.13 53.34,24.13 54.61,22.86 54.61,21.59 55.88,20.32 78.11,20.32 78.74,19.68 80.03,19.68 U3.3
USBCFG
  Top 0.203: R7.2 38.73,26.04 41.91,22.86 52.07,22.86 53.34,21.59 53.34,20.32 54.61,19.05 71.12,19.05 73.03,17.14 80,17.14 U3.7
V_MCP
  Top 0.203: 83.5,23.81 83.5,23.56
  Top 0.254: U3.11 83.82,19.05 82.55,20.32 | 82.55,20.32 82.55,21.59 | 82.55,21.59 82.55,22.48 C7.1 83.5,23.56 | U3.1 81.87,21 82.55,20.32 | R3.2 81.43,22.71 82.55,21.59 | 83.5,23.81 81.92,25.4 S3.2
VCC  (via drill 0.6)
  Top 0.305: U$4.1 90.07,19.05 88.9,19.05 88.01,18.16 C8.1 55.24,14.61 v54.61,13.97
  Top 0.406: U2.3 38.89,15.9 | 38.89,15.9 C5.P 34.74,17.32 31.75,20.32 D1.C | 38.89,15.9 35.56,12.57 35.56,10.16 JP6.2 JP4.2 v40.64,6.35
  Bottom 0.305: v54.61,13.97 54.61,2.54 53.34,1.27 43.18,1.27 41.91,2.54 41.91,5.08 v40.64,6.35
  other vias: 33.02,16.51 33.02,17.78 33.02,15.24 34.29,13.97 34.29,15.24 34.29,16.51 35.56,13.97 35.56,15.24 36.83,11.43 36.83,10.16 38.1,10.16 38.1,11.43 38.1,12.7 36.83,12.7 38.1,13.97 40.96,13.34 40.64,17.78
  pour Top: 31.75,19.05 41.91,19.05 41.91,12.7 38.1,8.89 34.29,8.89 34.29,12.7 31.75,15.24
  pour Bottom: 31.75,19.05 31.75,15.24 34.29,12.7 34.29,8.89 38.1,8.89 41.91,12.7 41.91,19.05

### Text on the board
tPlace: T5 | T6 | T7 | IO23 | IO22 | TX | RX | IO21 | IO19 | T5/IO12 | T6/IO14 | T7/IO27 | IO18 | IO5 | IO17 | IO16 | T2 | T3 | T4 | IO4 | IO0 | IO2 | IO15 | SD1 | SD0 | T2/IO2 | T3/IO15 | T4/IO13 | CLK | CMD | SD3 | SD2 | IO13 | GND | T0 | T1 | IO12 | IO14 | ESP32 Breakout / and Development Board | IO27 | IO26 | TX | RX | 3.3V | IO25 | IO35 | T0/IO4 | T1/IO0 | USBCFG | HEART | IO34 | SVN | Remove header to / disconnect HEART / LED and IO19 | SVP | EN | HEART/IO19 | SD_CARD | Switch to enable / USB-UART / flashing and / debugging | pullups / enabled | 5V | 3.3V | pullups / disabled | GND | GND
bPlace: ESP32 Breakout / D. Rances / 10 Sep 2017 v3 | Pullups for DAT0 / and DAT2 of microSD. / Keep disabled to flash / the ESP32